# Altium schematic sheet LEDs.SchDoc: front panel LEDs
size 420 x 297 mm; Author: G.K.; CompanyName: WUT; DrawnBy: G.K.; Organization: WUT ISE; Address1: Warsaw Univeristy of Technology; Address2: Nowowiejska 15/19; Revision: -; SheetNumber: -; SheetTotal: -; EDA_Number: ARTIQ; Projet: 8 Channel RF Power Amplifier; ModifiedBy: -; CreateDate: XX/XX/XXXX; CheckedDate: -; Title2: & registers; DivGrp: ISE; Designer: G.K.; ModifiedDate: -; ProjectName: 8 Channel RF Power Amplifier
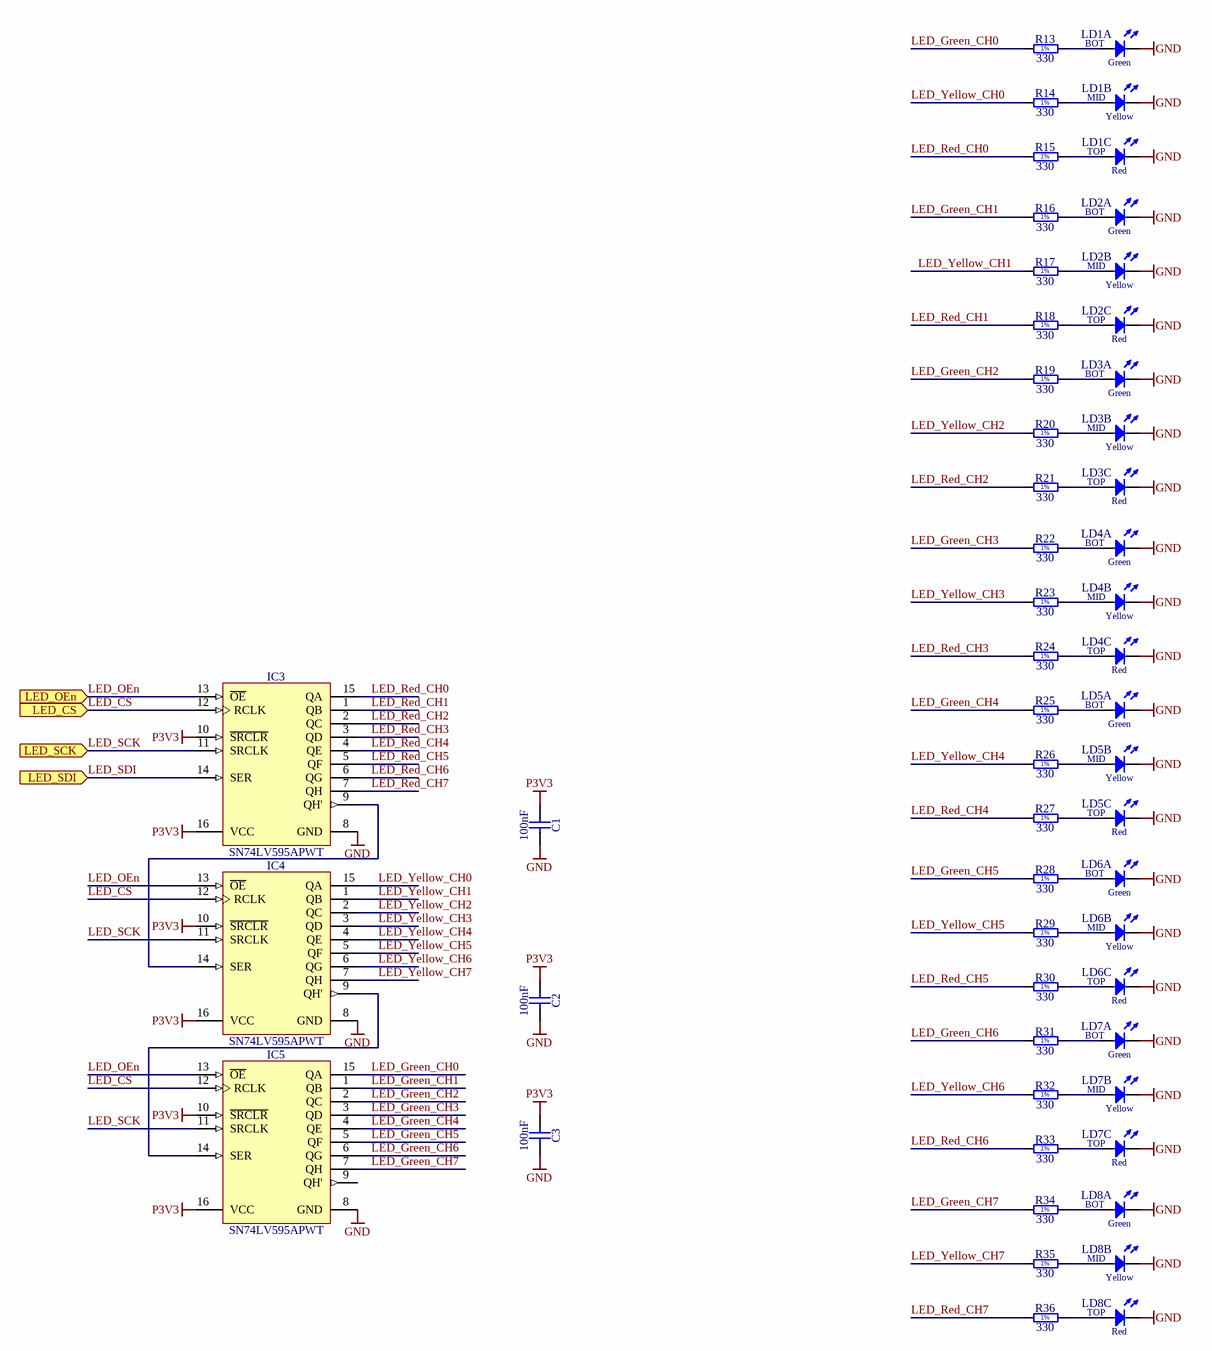
[diagram p0: LEDs.SchDoc]

## Parts
C1  100nF  [CAPC1005X55N]
C2  100nF  [CAPC1005X55N]
C3  100nF  [CAPC1005X55N]
IC3  SN74LV595APWT  [SOP65P640X120-16N]
IC4  SN74LV595APWT  [SOP65P640X120-16N]
IC5  SN74LV595APWT  [SOP65P640X120-16N]
LD1  Red/Yellow/Green  [LED_MENTOR_1882.2781]  (value not drawn)  (parts A,B,C of 3)
LD2  Red/Yellow/Green  [LED_MENTOR_1882.2781]  (value not drawn)  (parts A,B,C of 3)
LD3  Red/Yellow/Green  [LED_MENTOR_1882.2781]  (value not drawn)  (parts A,B,C of 3)
LD4  Red/Yellow/Green  [LED_MENTOR_1882.2781]  (value not drawn)  (parts A,B,C of 3)
LD5  Red/Yellow/Green  [LED_MENTOR_1882.2781]  (value not drawn)  (parts A,B,C of 3)
LD6  Red/Yellow/Green  [LED_MENTOR_1882.2781]  (value not drawn)  (parts A,B,C of 3)
LD7  Red/Yellow/Green  [LED_MENTOR_1882.2781]  (value not drawn)  (parts A,B,C of 3)
LD8  Red/Yellow/Green  [LED_MENTOR_1882.2781]  (value not drawn)  (parts A,B,C of 3)
R13  330  [RESC1608X55N]
R14  330  [RESC1608X55N]
R15  330  [RESC1608X55N]
R16  330  [RESC1608X55N]
R17  330  [RESC1608X55N]
R18  330  [RESC1608X55N]
R19  330  [RESC1608X55N]
R20  330  [RESC1608X55N]
R21  330  [RESC1608X55N]
R22  330  [RESC1608X55N]
R23  330  [RESC1608X55N]
R24  330  [RESC1608X55N]
R25  330  [RESC1608X55N]
R26  330  [RESC1608X55N]
R27  330  [RESC1608X55N]
R28  330  [RESC1608X55N]
R29  330  [RESC1608X55N]
R30  330  [RESC1608X55N]
R31  330  [RESC1608X55N]
R32  330  [RESC1608X55N]
R33  330  [RESC1608X55N]
R34  330  [RESC1608X55N]
R35  330  [RESC1608X55N]
R36  330  [RESC1608X55N]

## Ports
LED_CS (in), LED_OEn (in), LED_SCK (in), LED_SDI (in)

## Nets
GND: C1.2 C2.2 C3.2 IC3.8(GND) IC4.8(GND) IC5.8(GND) LD1.1(C) LD1.3(C) LD1.5(C) LD2.1(C) LD2.3(C) LD2.5(C) LD3.1(C) LD3.3(C) LD3.5(C) LD4.1(C) LD4.3(C) LD4.5(C) LD5.1(C) LD5.3(C) LD5.5(C) LD6.1(C) LD6.3(C) LD6.5(C) LD7.1(C) LD7.3(C) LD7.5(C) LD8.1(C) LD8.3(C) LD8.5(C)
P3V3: C1.1 C2.1 C3.1 IC3.10(~{SRCLR}) IC3.16(VCC) IC4.10(~{SRCLR}) IC4.16(VCC) IC5.10(~{SRCLR}) IC5.16(VCC)
LED_CS: IC3.12(RCLK) IC4.12(RCLK) IC5.12(RCLK) ; port LED_CS
LED_Green_CH0: IC5.15(QA) R13.1
LED_Green_CH1: IC5.1(QB) R16.1
LED_Green_CH2: IC5.2(QC) R19.1
LED_Green_CH3: IC5.3(QD) R22.1
LED_Green_CH4: IC5.4(QE) R25.1
LED_Green_CH5: IC5.5(QF) R28.1
LED_Green_CH6: IC5.6(QG) R31.1
LED_Green_CH7: IC5.7(QH) R34.1
LED_OEn: IC3.13(~{OE}) IC4.13(~{OE}) IC5.13(~{OE}) ; port LED_OEn
LED_Red_CH0: IC3.15(QA) R15.1
LED_Red_CH1: IC3.1(QB) R18.1
LED_Red_CH2: IC3.2(QC) R21.1
LED_Red_CH3: IC3.3(QD) R24.1
LED_Red_CH4: IC3.4(QE) R27.1
LED_Red_CH5: IC3.5(QF) R30.1
LED_Red_CH6: IC3.6(QG) R33.1
LED_Red_CH7: IC3.7(QH) R36.1
LED_SCK: IC3.11(SRCLK) IC4.11(SRCLK) IC5.11(SRCLK) ; port LED_SCK
LED_SDI: IC3.14(SER) ; port LED_SDI
LED_Yellow_CH0: IC4.15(QA) R14.1
LED_Yellow_CH1: IC4.1(QB) R17.1
LED_Yellow_CH2: IC4.2(QC) R20.1
LED_Yellow_CH3: IC4.3(QD) R23.1
LED_Yellow_CH4: IC4.4(QE) R26.1
LED_Yellow_CH5: IC4.5(QF) R29.1
LED_Yellow_CH6: IC4.6(QG) R32.1
LED_Yellow_CH7: IC4.7(QH) R35.1
NetIC3_9: IC3.9(QH') IC4.14(SER)
NetIC4_9: IC4.9(QH') IC5.14(SER)
NetLD1_2: LD1.2(A) R13.2
NetLD1_4: LD1.4(A) R14.2
NetLD1_6: LD1.6(A) R15.2
NetLD2_2: LD2.2(A) R16.2
NetLD2_4: LD2.4(A) R17.2
NetLD2_6: LD2.6(A) R18.2
NetLD3_2: LD3.2(A) R19.2
NetLD3_4: LD3.4(A) R20.2
NetLD3_6: LD3.6(A) R21.2
NetLD4_2: LD4.2(A) R22.2
NetLD4_4: LD4.4(A) R23.2
NetLD4_6: LD4.6(A) R24.2
NetLD5_2: LD5.2(A) R25.2
NetLD5_4: LD5.4(A) R26.2
NetLD5_6: LD5.6(A) R27.2
NetLD6_2: LD6.2(A) R28.2
NetLD6_4: LD6.4(A) R29.2
NetLD6_6: LD6.6(A) R30.2
NetLD7_2: LD7.2(A) R31.2
NetLD7_4: LD7.4(A) R32.2
NetLD7_6: LD7.6(A) R33.2
NetLD8_2: LD8.2(A) R34.2
NetLD8_4: LD8.4(A) R35.2
NetLD8_6: LD8.6(A) R36.2

Not connected (* = marked no-connect by the designer): IC5 9(QH')

## Notes on the sheet
- Project/Equipment
- Document
- Designer
- Drawn by
- Check.by
- File
- Last Mod.
- Print Date
- Sheet
- Size
- A3
- of
- Rev
- (in symbol LED_MENTOR_1882.2781, part A) BOT; Green
- (in symbol LED_MENTOR_1882.2781, part B) MID; Yellow
- (in symbol LED_MENTOR_1882.2781, part C) TOP; Red
- (in symbol R0603_330R_1%_0.1W_100PPM) 1%

## Library data of the parts
C1-C3 = CC0402_100NF_16V_10%_X7R: Non-polarised capacitor; Part Description: SMD Multilayer Chip Ceramic Capacitor; Manufacturer: GENERIC; Manufacturer1 Part Number: GRM155R71C104KA88D; Voltage: 16V; TC: X7R; Tolerance: ±10%; Part Number: CC0402_100NF_16V_10%_X7R; Component Kind: Standard; Component Type: Standard; Pin Count: 2; Value: 100nF; Status: Not Recommended; Manufacturer Part Number: CC0402_100NF_16V_10%_X7R; Case: 0402; Mounted: Yes; Socket: No; SMD: Yes; Manufacturer1 Example: MURATA; Manufacturer1 ComponentHeight: 0.55mm; HelpURL: \\cern.ch\dfs\Applications\Altium\Datasheets\CC0402_X7R_MURATA_GRM.pdf; Author: CERN DEM JLC; CreateDate: 05.12.2013; LatestRevisionDate: 03.12.2007; Sense: No
IC3-IC5 = SN74LV595APWT: 8-Bit Shift Register With 3-State Output Register; Manufacturer: TEXAS INSTRUMENTS; PressFit: No; Bonding: No; Part Number: SN74LV595APWT; Component Kind: Standard; Component Type: Standard; Device: SN74LV595APWT; PackageDescription: SOP, 0.65mm pitch; 16 pin, 4.40mm W X 5.00mm L X 1.20mm H body IPC Medium Density; Part Description: 8-Bit Shift Register With 3-State Output Register; Manufacturer Part Number: SN74LV595APWT; Pin Count: 16; Case: TSSOP16; Mounted: Yes; Socket: No; SMD: Yes; Sense: No; ComponentHeight: 1.2mm; Author: CERN DEM JLC; HelpURL: \\cern.ch\dfs\Applications\Altium\Datasheets\SN74LV595APWT.pdf; CreateDate: 10.05.2012; LatestRevisionDate: 10.05.2012
LD1-LD8 = LED_MENTOR_1882.2781: LED x3 G-1C2A-BOT_Y-3C4A_R-5C6A-TOP; Part Description: Triple 3mm LEDs, Red Top, Yellow Mid, Green Bot, PCB Edge Mounting; Manufacturer: MENTOR; PressFit: No; Bonding: No; Part Number: LED_MENTOR_1882.2781; Component Kind: Standard; Component Type: Standard; Color: Red/Yellow/Green; PackageDescription: 3x LED 3mm (Red+Yellow +Green) PCB Edge Mounting MENTOR 1882.2781; Manufacturer Part Number: 1882.2781; Pin Count: 6; Mounted: Yes; Socket: No; SMD: No; Sense: No; ComponentHeight: 12mm; HelpURL: \\cern.ch\dfs\Applications\Altium\Datasheets\LED_MENTOR_1882.2781.pdf; Author: CERN DEM JLC; CreateDate: 03.02.2009; LatestRevisionDate: 17.03.2010
R13-R36 = R0603_330R_1%_0.1W_100PPM: Resistor - 1%; Part Description: General Purpose Thick Film Chip Resistor; Manufacturer: GENERIC; Manufacturer1 Part Number: NRC06F3300TRF; Power: 0.1W; TC: ±100ppm/°C; Table: Resistors SMD; Part Number: R0603_330R_1%_0.1W_100PPM; Component Kind: Standard; Component Type: Standard; Pin Count: 2; Value: 330; Status: Preferred; Tolerance: ±1%; Manufacturer Part Number: R0603_330R_1%_0.1W_100PPM; Case: 0603; Mounted: Yes; Socket: No; SMD: Yes; Manufacturer1 Example: NIC COMPONENT; Manufacturer1 ComponentHeight: 0.55mm; HelpURL: \\cern.ch\dfs\Applications\Altium\Datasheets\R0603_NIC_NRC.pdf; Author: CERN DEM JLC; CreateDate: 2007-12-03; LatestRevisionDate: 2008-03-13